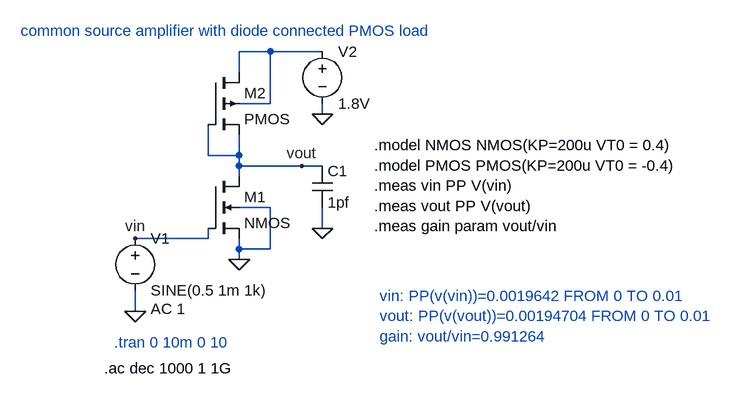
[diagram p0: schematic common_source_amp_diode_PMOS_load.asc]
common_source_amp_diode_PMOS_load.asc, the LTspice schematic file:
Version 4
SHEET 1 980 680
WIRE 256 -16 208 -16
WIRE 336 -16 256 -16
WIRE 208 16 208 -16
WIRE 256 64 256 -16
WIRE 256 64 208 64
WIRE 336 80 336 64
WIRE 160 144 160 96
WIRE 208 144 208 112
WIRE 208 144 160 144
WIRE 208 160 208 144
WIRE 304 160 208 160
WIRE 336 160 304 160
WIRE 208 176 208 160
WIRE 256 224 208 224
WIRE 336 256 336 224
WIRE 160 272 160 256
WIRE 160 272 48 272
WIRE 208 288 208 272
WIRE 256 288 256 224
WIRE 256 288 208 288
WIRE 208 304 208 288
WIRE 48 384 48 352
FLAG 336 80 0
FLAG 208 304 0
FLAG 336 256 0
FLAG 48 384 0
FLAG 304 160 vout
FLAG 48 272 vin
SYMBOL pmos4 160 16 R0
SYMATTR InstName M2
SYMATTR Value2 l=1u w=1u
SYMBOL voltage 48 256 R0
WINDOW 123 24 124 Left 2
WINDOW 39 0 0 Left 0
SYMATTR InstName V1
SYMATTR Value SINE(0.5 1m 1k)
SYMATTR Value2 AC 1
SYMBOL voltage 336 -32 R0
WINDOW 123 0 0 Left 0
WINDOW 39 0 0 Left 0
SYMATTR InstName V2
SYMATTR Value 1.8V
SYMBOL cap 320 160 R0
SYMATTR InstName C1
SYMATTR Value 1pf
SYMBOL nmos4 160 176 R0
SYMATTR InstName M1
TEXT 416 128 Left 2 !.model NMOS NMOS(KP=200u VT0 = 0.4)\n.model PMOS PMOS(KP=200u VT0 = -0.4)\n.meas vin PP V(vin)\n.meas vout PP V(vout)\n.meas gain param vout/vin
TEXT 16 432 Left 2 ;.tran 0 10m 0 10
TEXT -128 -48 Left 2 ;common source amplifier with diode connected PMOS load
TEXT 0 472 Left 2 !.ac dec 1000 1 1G
TEXT 424 360 Left 2 ;vin: PP(v(vin))=0.0019642 FROM 0 TO 0.01\nvout: PP(v(vout))=0.00194704 FROM 0 TO 0.01\ngain: vout/vin=0.991264

The netlist it stands for:
* common_source_amp_diode_PMOS_load.asc
M2 N001 vout vout N001 PMOS l=1u w=1u
V1 vin 0 SINE(0.5 1m 1k) AC 1
V2 N001 0 1.8V
C1 vout 0 1pf
M1 vout vin 0 0 NMOS
.model NMOS NMOS
.model PMOS PMOS
.lib standard.mos
.model NMOS NMOS(KP=200u VT0 = 0.4)
.model PMOS PMOS(KP=200u VT0 = -0.4)
.meas vin PP V(vin)
.meas vout PP V(vout)
.meas gain param vout/vin
* .tran 0 10m 0 10
* common source amplifier with diode connected PMOS load
.ac dec 1000 1 1G
* vin: PP(v(vin))=0.0019642 FROM 0 TO 0.01
* vout: PP(v(vout))=0.00194704 FROM 0 TO 0.01
* gain: vout/vin=0.991264
.backanno
.end